# EAGLE design M516 (EAGLE 6.6.0)
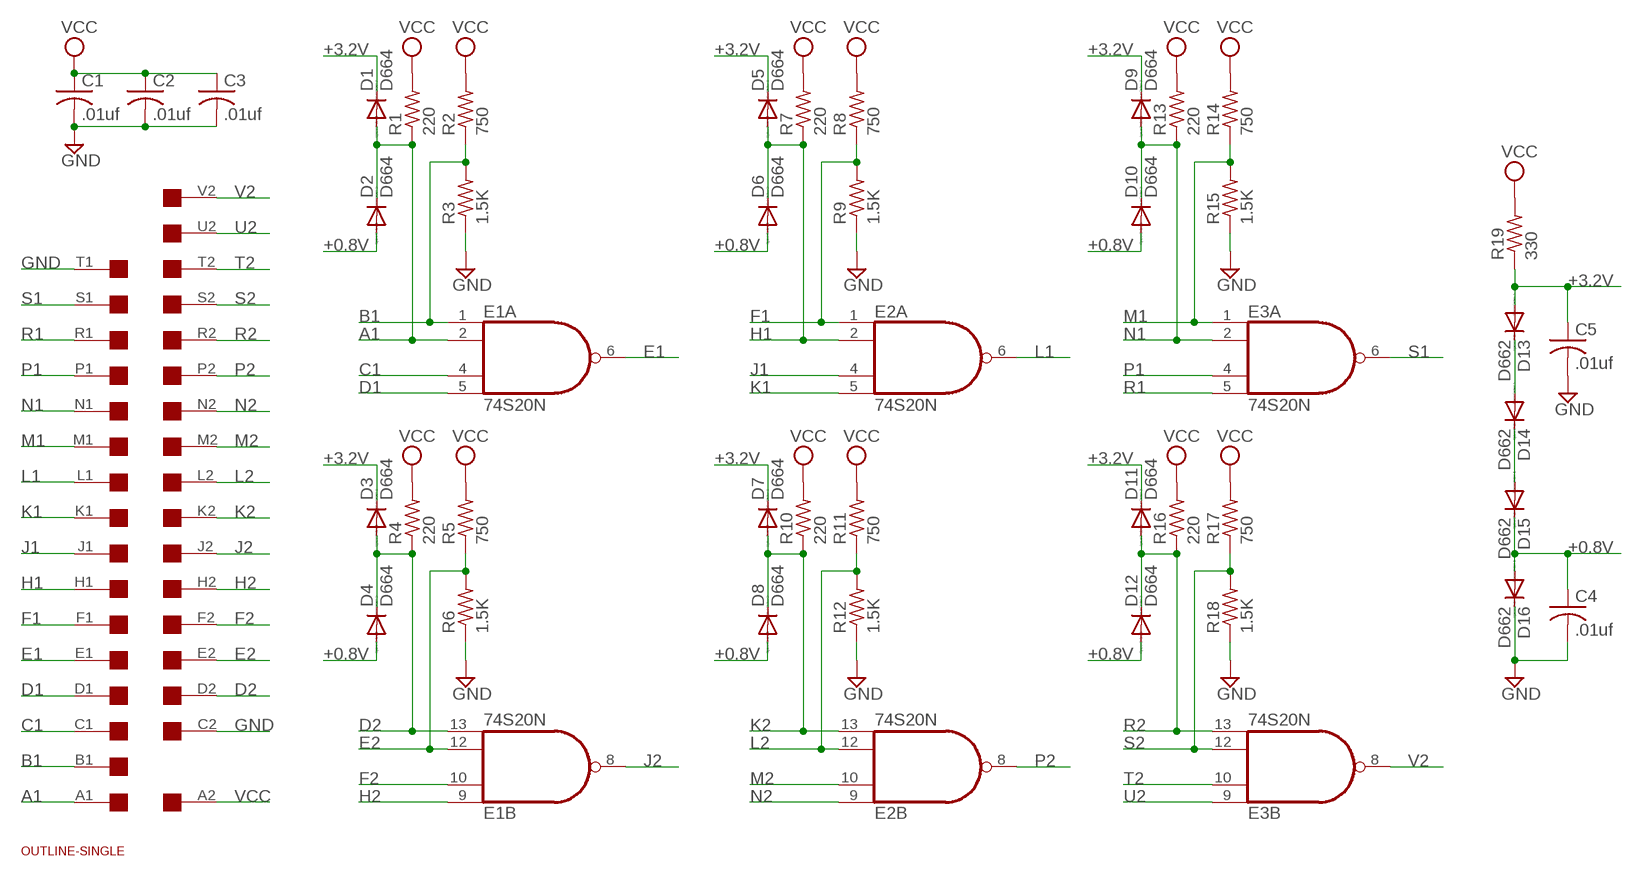
[diagram p0: schematic, sheet 1]

## Parts
C1  .01uf  C-US050-025X075  [C050-025X075]
C2  .01uf  C-US050-025X075  [C050-025X075]
C3  .01uf  C-US050-025X075  [C050-025X075]
C4  .01uf  C-US050-025X075  [C050-025X075]
C5  .01uf  C-US050-025X075  [C050-025X075]
D1  D664  1N4148DO35-10  [DO35-10]
D2  D664  1N4148DO35-10  [DO35-10]
D3  D664  1N4148DO35-10  [DO35-10]
D4  D664  1N4148DO35-10  [DO35-10]
D5  D664  1N4148DO35-10  [DO35-10]
D6  D664  1N4148DO35-10  [DO35-10]
D7  D664  1N4148DO35-10  [DO35-10]
D8  D664  1N4148DO35-10  [DO35-10]
D9  D664  1N4148DO35-10  [DO35-10]
D10  D664  1N4148DO35-10  [DO35-10]
D11  D664  1N4148DO35-10  [DO35-10]
D12  D664  1N4148DO35-10  [DO35-10]
D13  D662  1N4148DO35-10  [DO35-10]
D14  D662  1N4148DO35-10  [DO35-10]
D15  D662  1N4148DO35-10  [DO35-10]
D16  D662  1N4148DO35-10  [DO35-10]
E1  74S20N  [DIL14]
E2  74S20N  [DIL14]
E3  74S20N  [DIL14]
R1  220  R-US_0207/10  [0207/10]
R2  750  R-US_0207/10  [0207/10]
R3  1.5K  R-US_0207/10  [0207/10]
R4  220  R-US_0207/10  [0207/10]
R5  750  R-US_0207/10  [0207/10]
R6  1.5K  R-US_0207/10  [0207/10]
R7  220  R-US_0207/10  [0207/10]
R8  750  R-US_0207/10  [0207/10]
R9  1.5K  R-US_0207/10  [0207/10]
R10  220  R-US_0207/10  [0207/10]
R11  750  R-US_0207/10  [0207/10]
R12  1.5K  R-US_0207/10  [0207/10]
R13  220  R-US_0207/10  [0207/10]
R14  750  R-US_0207/10  [0207/10]
R15  1.5K  R-US_0207/10  [0207/10]
R16  220  R-US_0207/10  [0207/10]
R17  750  R-US_0207/10  [0207/10]
R18  1.5K  R-US_0207/10  [0207/10]
R19  330  R-US_0207/10  [0207/10]
U$1  OUTLINE-SINGLE  [SINGLE]
U$2  SINGLE  [EDGE-CON2]

## Nets
+0.8V: C4.1 D2.A D4.A D6.A D8.A D10.A D12.A D15.C D16.A
+3.2V: C5.1 D1.C D3.C D5.C D7.C D9.C D11.C D13.A R19.1
A1: D1.A D2.C E1.2(A:I1) R1.1 U$2.A1
B1: E1.1(A:I0) R2.1 R3.2 U$2.B1
C1: E1.4(A:I2) U$2.C1
D1: E1.5(A:I3) U$2.D1
D2: D3.A D4.C E1.13(B:I3) R4.1 U$2.D2
E1: E1.6(A:O) U$2.E1
E2: E1.12(B:I2) R5.1 R6.2 U$2.E2
F1: E2.1(A:I0) R8.1 R9.2 U$2.F1
F2: E1.10(B:I1) U$2.F2
GND [Supply]: C1.2 C2.2 C3.2 C4.2 C5.2 D16.C R3.1 R6.1 R9.1 R12.1 R15.1 R18.1 U$2.C2 U$2.T1
H1: D5.A D6.C E2.2(A:I1) R7.1 U$2.H1
H2: E1.9(B:I0) U$2.H2
J1: E2.4(A:I2) U$2.J1
J2: E1.8(B:O) U$2.J2
K1: E2.5(A:I3) U$2.K1
K2: D7.A D8.C E2.13(B:I3) R10.1 U$2.K2
L1: E2.6(A:O) U$2.L1
L2: E2.12(B:I2) R11.1 R12.2 U$2.L2
M1: E3.1(A:I0) R14.1 R15.2 U$2.M1
M2: E2.10(B:I1) U$2.M2
N1: D9.A D10.C E3.2(A:I1) R13.1 U$2.N1
N2: E2.9(B:I0) U$2.N2
N$49: D13.C D14.A
N$50: D14.C D15.A
P1: E3.4(A:I2) U$2.P1
P2: E2.8(B:O) U$2.P2
R1: E3.5(A:I3) U$2.R1
R2: D11.A D12.C E3.13(B:I3) R16.1 U$2.R2
S1: E3.6(A:O) U$2.S1
S2: E3.12(B:I2) R17.1 R18.2 U$2.S2
T2: E3.10(B:I1) U$2.T2
U2: E3.9(B:I0) U$2.U2
V2: E3.8(B:O) U$2.V2
VCC [Supply]: C1.1 C2.1 C3.1 R1.2 R2.2 R4.2 R5.2 R7.2 R8.2 R10.2 R11.2 R13.2 R14.2 R16.2 R17.2 R19.2 U$2.A2
Unconnected: U$2.B2 U$2.U1 U$2.V1

## Power pins joined to a net without a drawn wire
GND: E1.7(P:GND) E2.7(P:GND) E3.7(P:GND)
VCC: E1.14(P:VCC) E2.14(P:VCC) E3.14(P:VCC)

## Library data of the parts
C1-C5 = rcl:C-US: CAPACITOR, American symbol
D1-D16 = diode:1N4148: DIODE high speed (Philips)
E1-E3 = 74xx-us:74*20: Dual 4-input NAND gate
R1-R19 = rcl:R-US_: RESISTOR, American symbol
U$1 = dec-con:OUTLINE-*: Board outlines for DEC boards.
U$2 = dec-con:SINGLE: Single-Height DEC board

## Net classes
1 Supply: width 0.635 mm

## Board
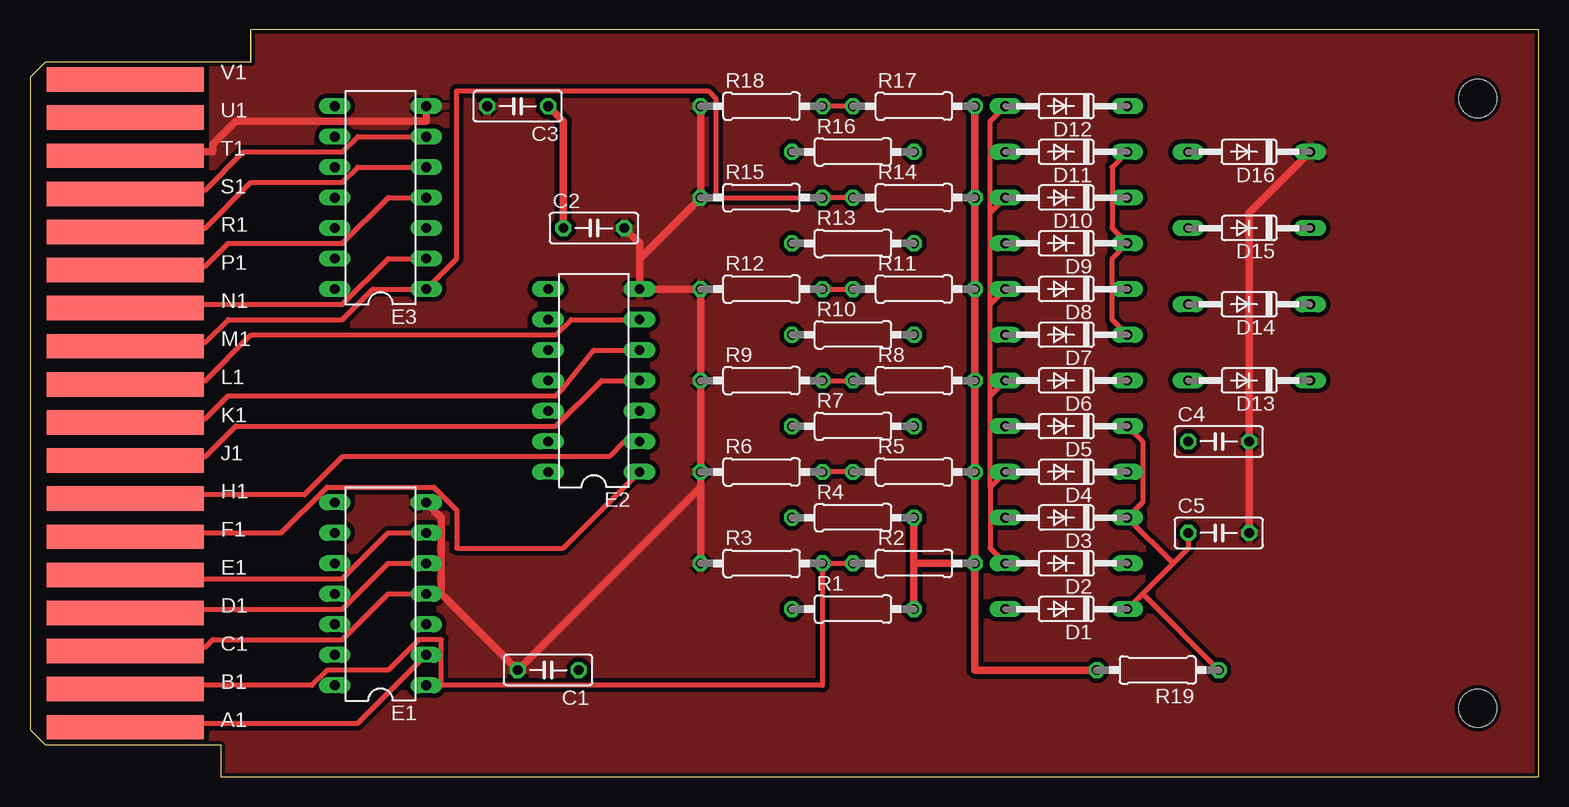
[diagram p1: board, top side]
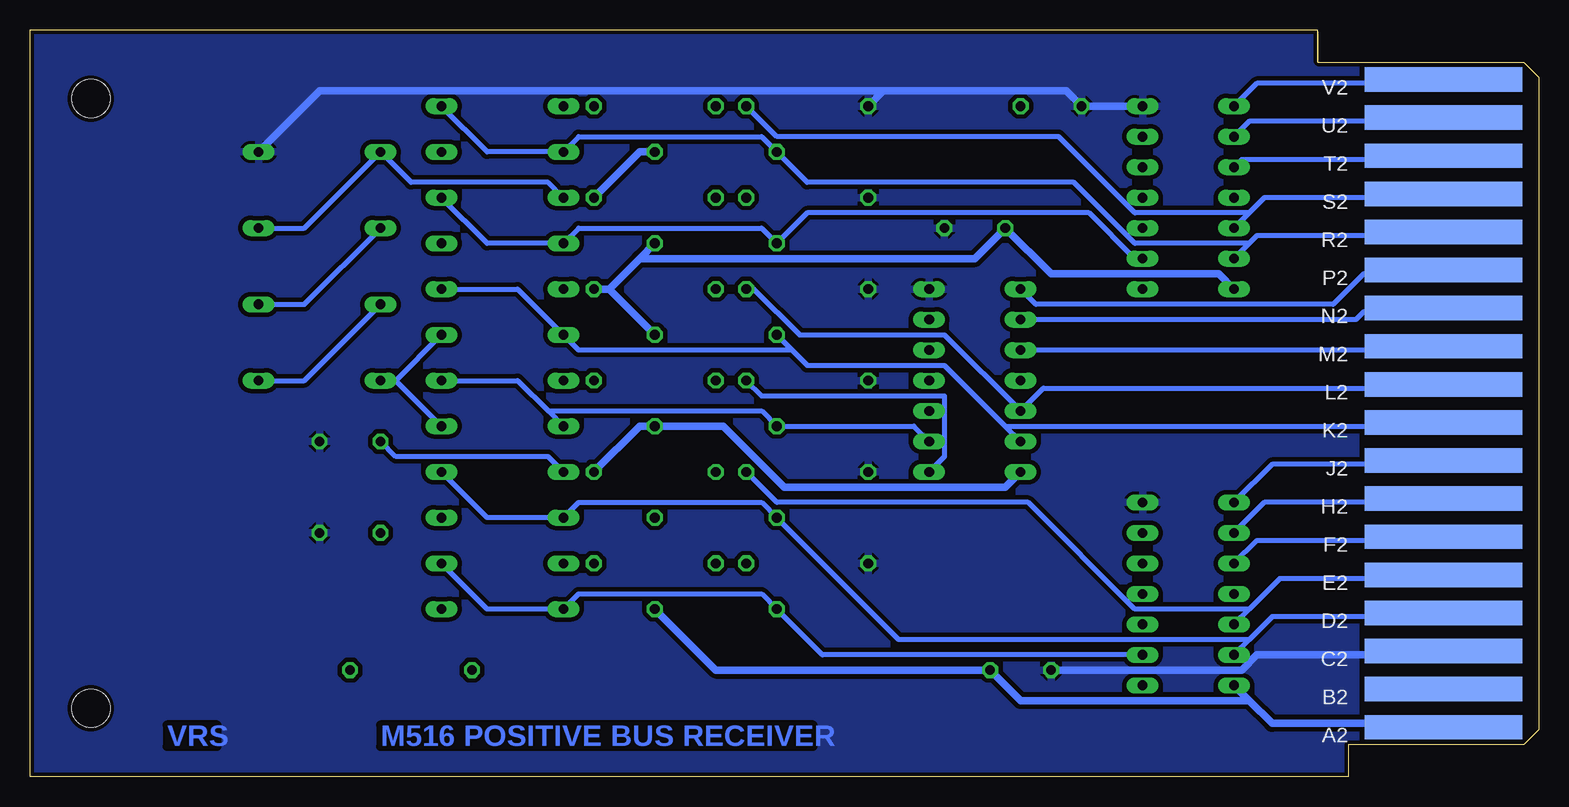
[diagram p2: board, bottom side, seen from below]

Size 125.73 x 62.23 mm. Coordinates in mm from the lower left corner, seen from the top.
Copper layers (1+16): Top 0.035mm / dielectric 1.5mm / Bottom 0.035mm
Design rules "16mils": minimum track width 16mil, minimum drill 32mil, track to track 15mil, track to pad 10mil, pad to pad 10mil, via to via 10mil, smd to smd 10mil, copper to edge 13mil, drill to drill 10mil, minimum pad ring 10mil, minimum via ring 8mil, stop-mask expansion 0mil, vias tented up to drill 0mil, thermal gap 10mil

### Footprints (pad centres in the part's own frame; a part is rotated, then mirrored left to right if it is on the bottom)
C050-025X075 = drill 0.813 octagon: 1 -2.54,0; 2 2.54,0
DO35-10 = drill 0.813 long: A 5.08,0; C -5.08,0
DIL14 = drill 0.813 long: 1 -7.62,-3.81; 2 -5.08,-3.81; 3 -2.54,-3.81; 4 0,-3.81; 5 2.54,-3.81; 6 5.08,-3.81; 7 7.62,-3.81; 8 7.62,3.81; 9 5.08,3.81; 10 2.54,3.81; 11 0,3.81; 12 -2.54,3.81; 13 -5.08,3.81; 14 -7.62,3.81
0207/10 = drill 0.813 octagon: 1 -5.08,0; 2 5.08,0
SINGLE = hole 3.175: 120.65,56.515; 120.65,5.715
EDGE-CON2 = smd 13.106 x 2.032: A1 7.938,4.128; B1 7.938,7.303; C1 7.938,10.477; D1 7.938,13.652; E1 7.938,16.828; F1 7.938,20.003; H1 7.938,23.177; J1 7.938,26.352; K1 7.938,29.527; L1 7.938,32.703; M1 7.938,35.877; N1 7.938,39.053; P1 7.938,42.227; R1 7.938,45.403; S1 7.938,48.578; T1 7.938,51.752; U1 7.938,54.928; V1 7.938,58.102 | smd 13.106 x 2.032 bottom: A2 7.938,4.128; B2 7.938,7.303; C2 7.938,10.477; D2 7.938,13.652; E2 7.938,16.828; F2 7.938,20.003; H2 7.938,23.177; J2 7.938,26.352; K2 7.938,29.527; L2 7.938,32.703; M2 7.938,35.877; N2 7.938,39.053; P2 7.938,42.227; R2 7.938,45.403; S2 7.938,48.578; T2 7.938,51.752; U2 7.938,54.928; V2 7.938,58.102

### Placement (x,y rotation side)
C1  43.18,8.89 180 top
C2  46.99,45.72 0 top
C3  40.64,55.88 180 top
C4  99.06,27.94 0 top
C5  99.06,20.32 0 top
D1  86.36,13.97 180 top
D2  86.36,17.78 180 top
D3  86.36,21.59 180 top
D4  86.36,25.4 180 top
D5  86.36,29.21 180 top
D6  86.36,33.02 180 top
D7  86.36,36.83 180 top
D8  86.36,40.64 180 top
D9  86.36,44.45 180 top
D10  86.36,48.26 180 top
D11  86.36,52.07 180 top
D12  86.36,55.88 180 top
D13  101.6,33.02 180 top
D14  101.6,39.37 180 top
D15  101.6,45.72 180 top
D16  101.6,52.07 180 top
E1  29.21,15.24 90 top
E2  46.99,33.02 90 top
E3  29.21,48.26 90 top
R1  68.58,13.97 0 top
R2  73.66,17.78 0 top
R3  60.96,17.78 0 top
R4  68.58,21.59 0 top
R5  73.66,25.4 0 top
R6  60.96,25.4 0 top
R7  68.58,29.21 0 top
R8  73.66,33.02 0 top
R9  60.96,33.02 0 top
R10  68.58,36.83 0 top
R11  73.66,40.64 0 top
R12  60.96,40.64 0 top
R13  68.58,44.45 0 top
R14  73.66,48.26 0 top
R15  60.96,48.26 0 top
R16  68.58,52.07 0 top
R17  73.66,55.88 0 top
R18  60.96,55.88 0 top
R19  93.98,8.89 180 top
U$1  0,0 0 top
U$2  0,0 0 top

### Tracks (layer width: path | path; a pad name or v marks a point on that pad's centre or on a via)
+0.8V
  Top 0.406: D2.A 80.01,19.05 80.01,24.13 | D4.A 80.01,24.13 | 80.01,31.75 D6.A | 80.01,24.13 80.01,31.75 | 80.01,39.37 D8.A | 80.01,31.75 80.01,39.37 | 80.01,46.99 D10.A | 80.01,39.37 80.01,46.99 | D12.A 80.01,54.61 80.01,46.99
  Bottom 0.406: D15.C 102.87,45.72 D16.A 93.98,49.53 82.55,49.53 D10.A | C4.1 95.25,26.67 82.55,26.67 D4.A
+3.2V
  Top 0.406: 95.25,17.78 96.52,19.05 C5.1 | 95.25,17.78 92.71,15.24 | 92.71,15.24 D1.C | 95.25,17.78 D3.C 92.71,22.86 92.71,27.94 D5.C | 92.71,15.24 R19.1 | D11.C 90.17,50.8 90.17,45.72 D9.C 90.17,43.18 90.17,38.1 D7.C
  Bottom 0.406: 95.25,33.02 D5.C | D13.A 95.25,33.02 | 95.25,33.02 D7.C
A1
  Top 0.406: E1.2 27.31,4.45 8.26,4.45 U$2.A1
  Bottom 0.406: D2.C 87.63,13.97 D1.A 80.01,15.24 64.77,15.24 R1.1 59.69,10.16 E1.2
B1
  Top 0.406: 34.29,7.62 66.04,7.62 R3.2 R2.1 | 34.29,7.62 E1.1 | 34.29,7.62 34.29,11.43 32.39,11.43 29.85,8.89 24.77,8.89 23.5,7.62 8.26,7.62 U$2.B1
C1
  Top 0.406: E1.4 29.85,15.24 26.04,11.43 15.24,11.43 14.61,10.79 8.26,10.79 U$2.C1
D1
  Top 0.406: E1.5 29.85,17.78 26.04,13.97 8.26,13.97 U$2.D1
D2
  Bottom 0.406: D4.C 87.63,21.59 D3.A 80.01,22.86 64.77,22.86 R4.1 53.34,11.43 24.13,11.43 | 24.13,11.43 22.23,13.34 8.26,13.34 U$2.D2 | 24.13,11.43 E1.13
E1
  Top 0.406: E1.6 29.85,20.32 26.04,16.51 8.26,16.51 U$2.E1
E2
  Top 0.406: R5.1 R6.2
  Bottom 0.406: 24.13,13.97 21.59,16.51 8.26,16.51 U$2.E2 | 24.13,13.97 E1.12 | R6.2 63.5,22.86 42.55,22.86 33.66,13.97 24.13,13.97
F1
  Top 0.406: R9.2 R8.1 | E2.1 44.45,19.05 35.56,19.05 35.56,22.23 33.66,24.13 24.77,24.13 20.96,20.32 8.26,20.32 U$2.F1
  Bottom 0.406: E2.1 49.53,26.67 49.53,31.75 64.77,31.75 R9.2
F2
  Bottom 0.406: E1.10 23.5,19.68 8.26,19.68 U$2.F2
GND
  Top 0.635: C5.2 C4.2 101.6,46.99 D16.C | E1.7 34.29,21.59 34.29,15.24 C1.2 55.88,24.13 | 55.88,24.13 R6.1 R9.1 R12.1 E2.7 50.8,43.18 | 55.88,24.13 R3.1 | C2.2 50.8,44.45 50.8,43.18 | 50.8,43.18 R15.1 R18.1 | E3.7 33.02,54.61 17.15,54.61 15.24,52.7 15.24,52.07 8.26,52.07 U$2.T1
  Bottom 0.635: E3.7 C3.2 39.37,57.15 54.61,57.15 | R18.1 54.61,57.15 | C1.2 24.77,8.89 23.5,10.16 8.26,10.16 U$2.C2 | D16.C 101.6,57.15 54.61,57.15
  pour Top: 125.73,0 125.73,62.23 15.24,62.23 15.24,0
  pour Bottom: 16.51,0 125.73,0 125.73,62.23 15.24,62.23 15.24,0
H1
  Top 0.406: E2.2 49.53,27.94 48.26,26.67 26.04,26.67 22.86,23.5 8.26,23.5 U$2.H1
  Bottom 0.406: E2.2 52.07,29.21 R7.1 64.77,30.48 82.55,30.48 | 82.55,30.48 85.09,33.02 D6.C | 82.55,30.48 D5.A
H2
  Bottom 0.406: E1.9 22.86,22.86 8.26,22.86 U$2.H2
J1
  Top 0.406: E2.4 47.63,33.02 43.82,29.21 17.15,29.21 14.61,26.67 8.26,26.67 U$2.J1
J2
  Bottom 0.406: E1.8 22.23,26.04 8.26,26.04 U$2.J2
K1
  Top 0.406: E2.5 46.99,35.56 44.45,32.38 43.82,31.75 16.51,31.75 14.61,29.84 8.26,29.84 U$2.K1
K2
  Bottom 0.406: D8.C 85.09,40.64 D7.A 80.01,35.56 62.23,35.56 | 44.45,29.21 49.53,34.29 60.96,34.29 62.23,35.56 | 44.45,29.21 E2.13 | R10.1 62.23,35.56 | 44.45,29.21 8.26,29.21 U$2.K2
L1
  Top 0.406: E2.6 45.09,38.1 43.82,36.83 18.42,36.83 14.61,33.02 8.26,33.02 U$2.L1
L2
  Top 0.406: R12.2 R11.1
  Bottom 0.406: R12.2 65.41,40.64 61.6,36.83 49.53,36.83 E2.12 41.28,32.38 8.26,32.38 U$2.L2
M1
  Top 0.406: R14.1 R15.2 57.15,48.26 57.15,56.52 56.52,57.15 35.56,57.15 35.56,43.18 E3.1 28.58,40.64 26.04,38.1 16.51,38.1 14.61,36.2 8.26,36.2 U$2.M1
M2
  Bottom 0.406: E2.10 8.26,35.56 U$2.M2
N1
  Top 0.406: E3.2 29.85,43.18 26.04,39.37 8.26,39.37 U$2.N1
  Bottom 0.406: D10.C 87.63,44.45 D9.A 80.01,45.72 64.77,45.72 R13.1 60.96,46.99 37.47,46.99 33.66,43.18 E3.2
N2
  Bottom 0.406: E2.9 15.24,38.1 14.61,38.73 8.26,38.73 U$2.N2
N$49
  Bottom 0.406: D14.A 102.87,33.02 D13.C
N$50
  Bottom 0.406: D15.A 102.87,39.37 D14.C
P1
  Top 0.406: E3.4 29.85,48.26 26.04,44.45 16.51,44.45 14.61,42.55 8.26,42.55 U$2.P1
P2
  Bottom 0.406: E2.8 41.91,39.37 17.15,39.37 14.61,41.91 8.26,41.91 U$2.P2
R1
  Top 0.406: E3.5 27.31,50.8 26.04,49.53 18.42,49.53 14.61,45.72 8.26,45.72 U$2.R1
R2
  Bottom 0.406: D12.C 87.63,52.07 D11.A 80.01,53.34 64.77,53.34 R16.1 60.96,49.53 38.74,49.53 33.66,44.45 24.13,44.45 | 24.13,44.45 23.5,45.09 8.26,45.09 U$2.R2 | 24.13,44.45 E3.13
S1
  Top 0.406: E3.6 27.31,53.34 26.04,52.07 17.78,52.07 14.61,48.9 8.26,48.9 U$2.S1
S2
  Top 0.406: R17.1 R18.2
  Bottom 0.406: 24.13,46.99 22.86,48.26 8.26,48.26 U$2.S2 | 24.13,46.99 E3.12 | R18.2 63.5,53.34 40.01,53.34 33.66,46.99 24.13,46.99
T2
  Bottom 0.406: E3.10 24.77,51.44 8.26,51.44 U$2.T2
U2
  Bottom 0.406: E3.9 24.13,54.61 8.26,54.61 U$2.U2
V2
  Bottom 0.406: E3.8 23.5,57.78 8.26,57.78 U$2.V2
VCC
  Top 0.635: C3.1 44.45,54.61 C2.1 | R17.2 R14.2 R11.2 R8.2 R5.2 R2.2 | R4.2 73.66,17.78 | 73.66,17.78 R1.2 | 73.66,17.78 R2.2 | R19.2 78.74,8.89 R2.2
  Bottom 0.635: 24.13,6.35 22.23,4.45 8.26,4.45 U$2.A2 | 24.13,6.35 E1.14 | 24.13,6.35 43.18,6.35 C1.1 68.58,8.89 R1.2 | E3.14 26.67,41.91 40.64,41.91 C2.1 46.99,43.18 74.93,43.18 | R14.2 74.93,52.07 R16.2 | 77.47,40.64 R10.2 | R11.2 77.47,40.64 | 77.47,40.64 74.93,43.18 | 74.93,43.18 R13.2 | E2.14 44.45,24.13 62.87,24.13 67.95,29.21 R7.2 74.93,29.21 R5.2

### Text on the board
Bottom: M516 POSITIVE BUS RECEIVER | VRS